# Altium schematic sheet Sheet1.SchDoc
size A2; SheetNumber: 1; SheetTotal: 1
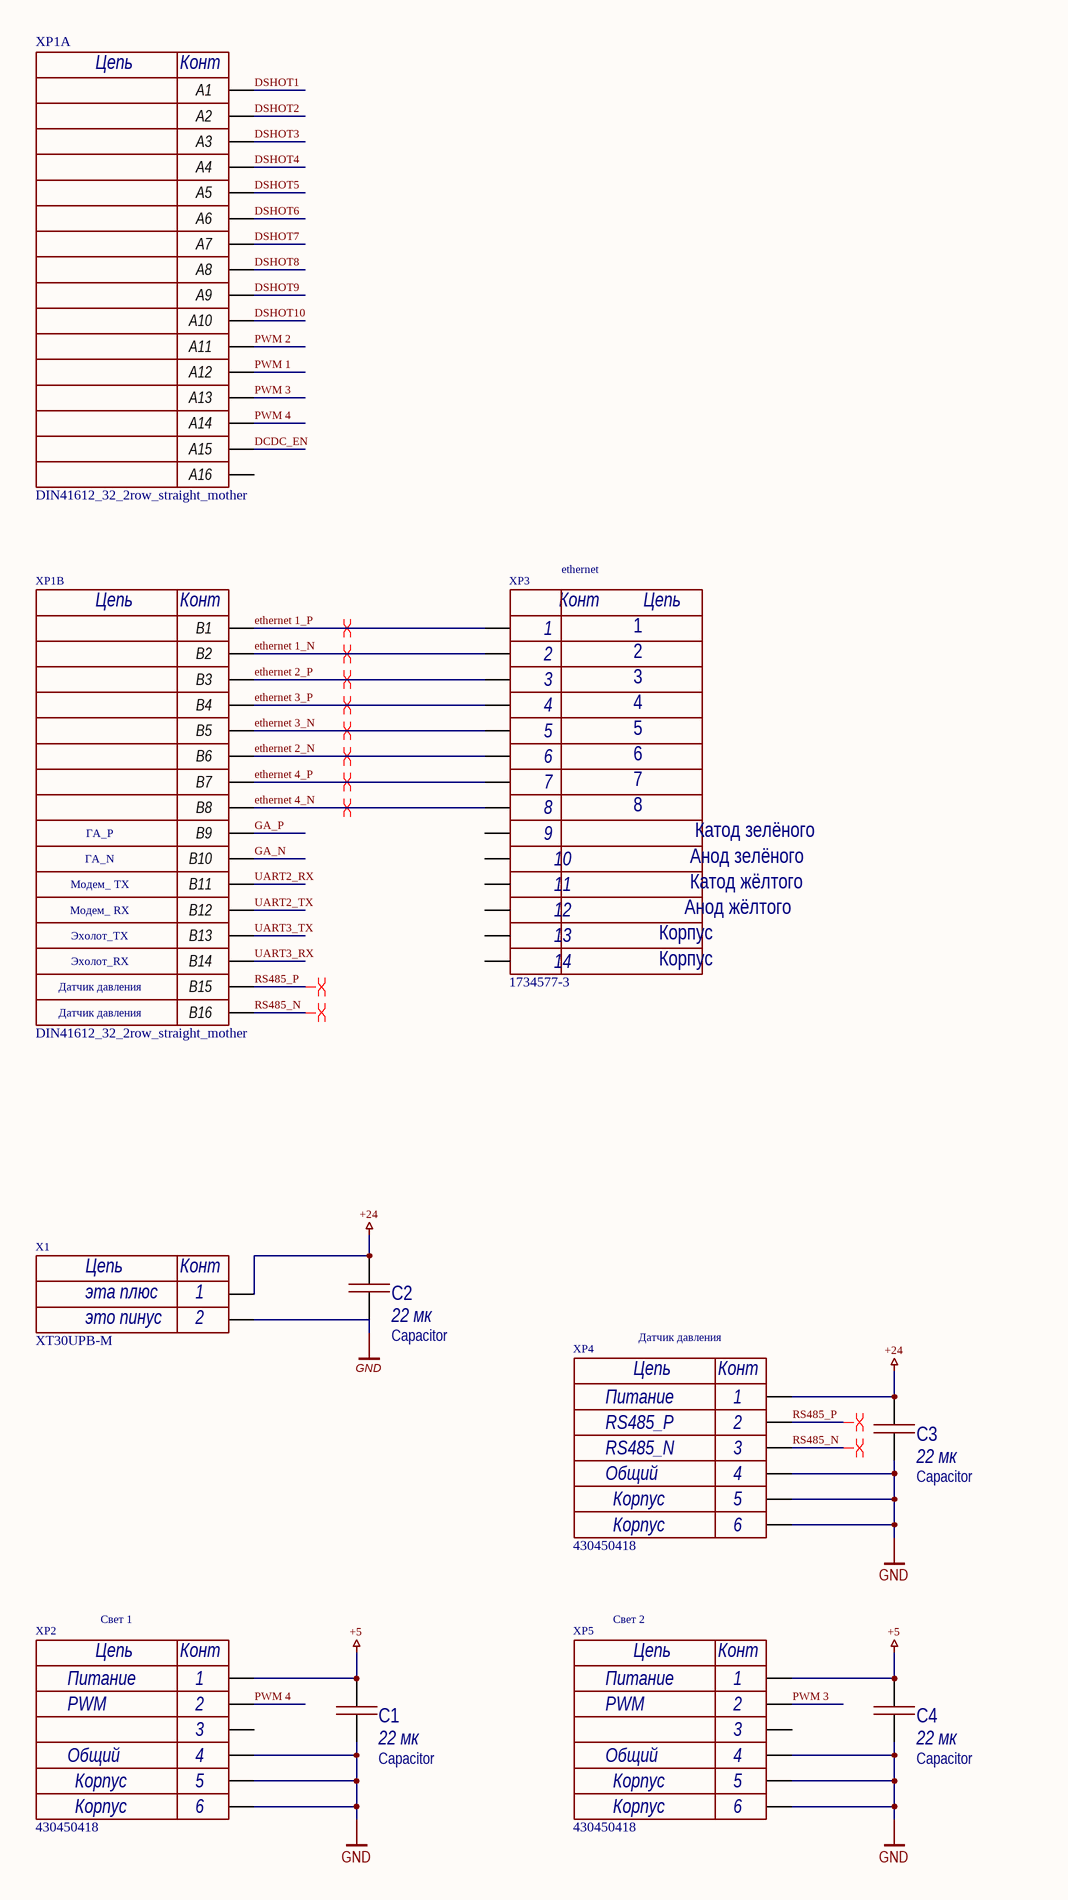
[diagram p0: Sheet1.SchDoc, left]
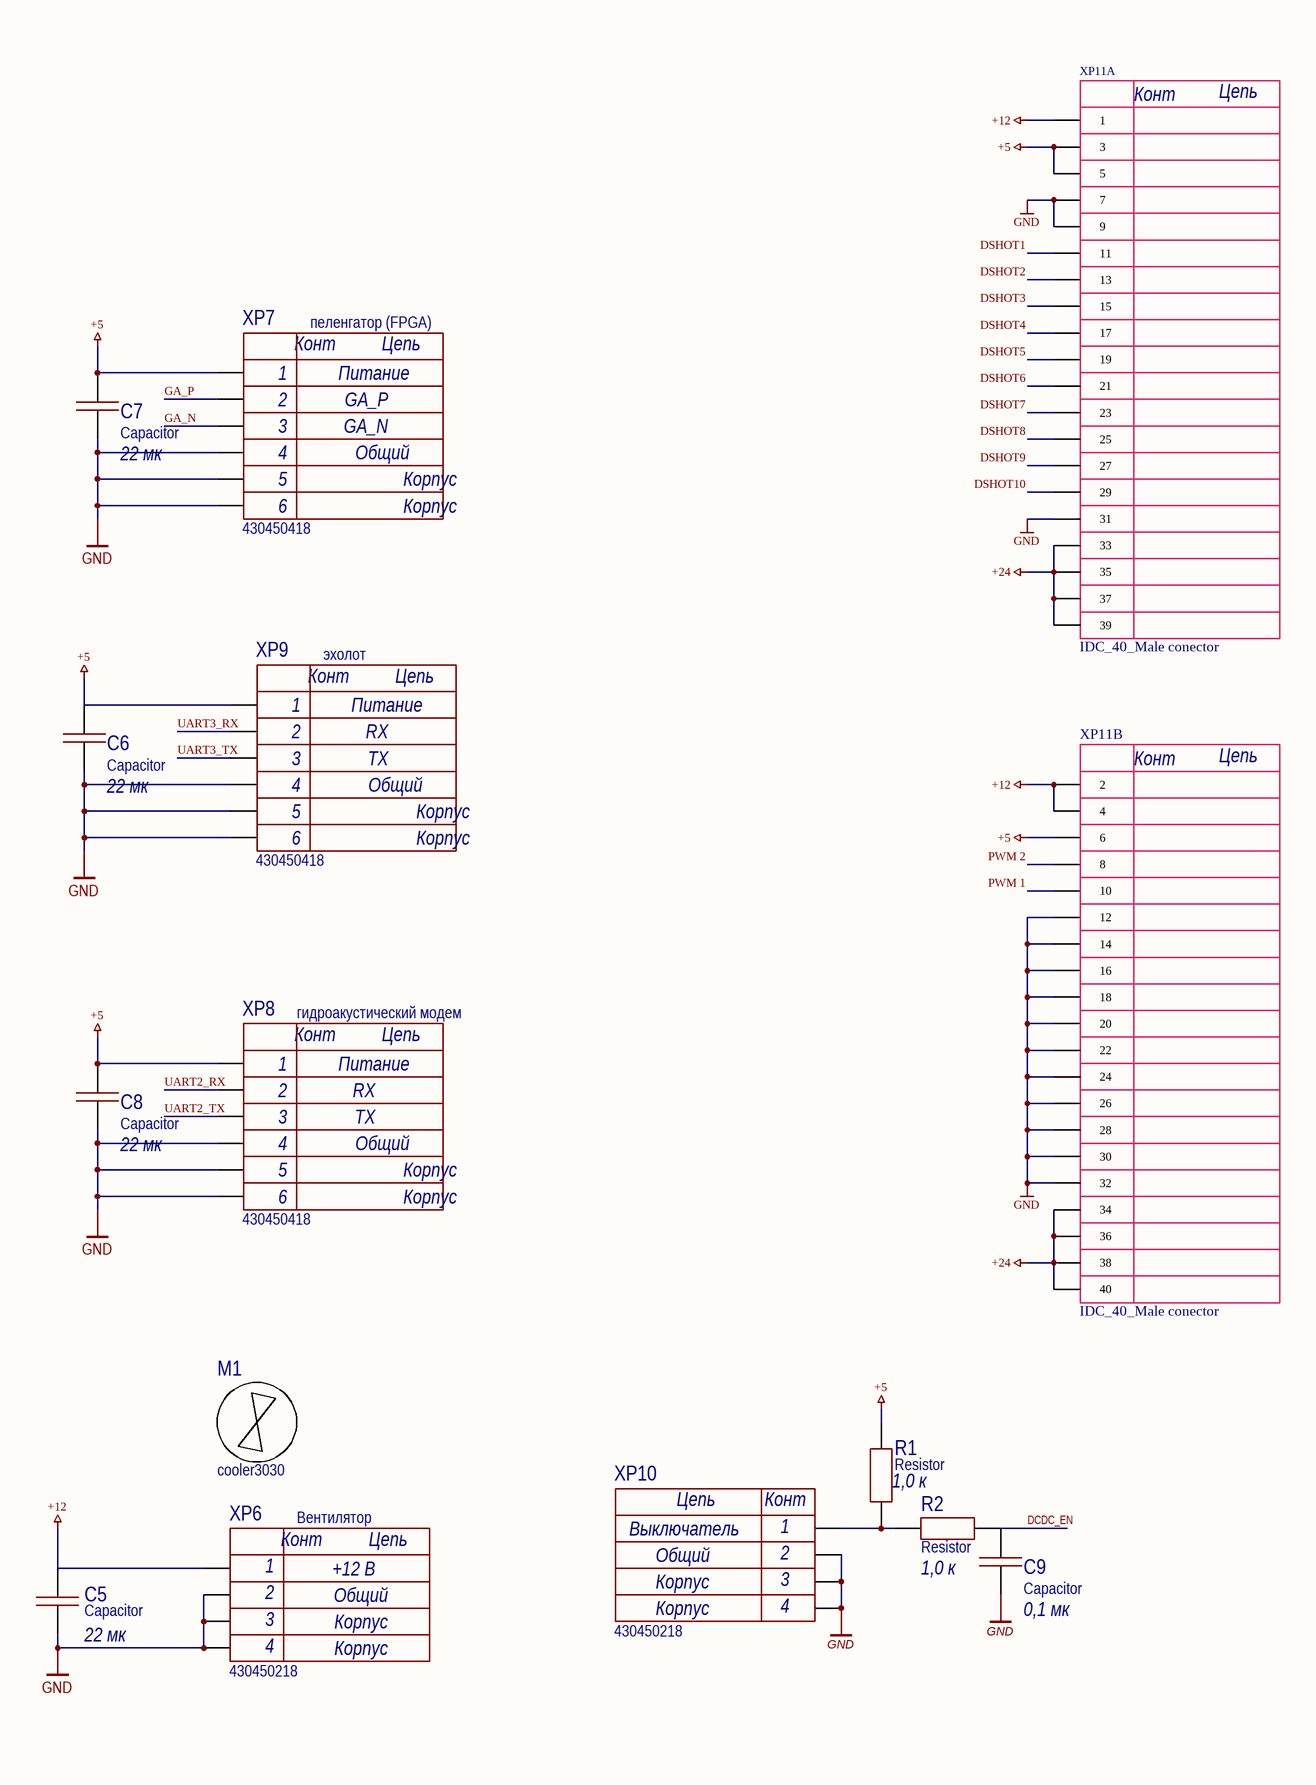
[diagram p1: Sheet1.SchDoc, right]

## Parts
C1  Capacitor  value 22 мк  [1210C]
C2  Capacitor  value 22 мк  [1210C]
C3  Capacitor  value 22 мк  [1210C]
C4  Capacitor  value 22 мк  [1210C]
C5  Capacitor  value 22 мк  [1210C]
C6  Capacitor  value 22 мк  [1210C]
C7  Capacitor  value 22 мк  [1210C]
C8  Capacitor  value 22 мк  [1210C]
C9  Capacitor  value 0,1 мк  [0603C]
M1  cooler3030  [cooler3030]
R1  Resistor  value 1,0 к  [0603R]
R2  Resistor  value 1,0 к  [0603R]
X1  XT30UPB-M  Value2: это пинус  Value1: эта плюс  [XT30UPB-M]
XP1  DIN41612_32_2row_straight_mother  [DIN41612_32_2row_straight_mother]  (parts A,B of 2)
XP2  430450418  Value1: Питание  Value2: PWM  Value4: Общий  [MOLEX_430450418]
XP3  1734577-3  [1-1734577-3-rj45-8p8c]
XP4  430450418  Value1: Питание  Value2: RS485_P  Value3: RS485_N  Value4: Общий  [MOLEX_430450418]
XP5  430450418  Value1: Питание  Value2: PWM  Value4: Общий  [MOLEX_430450418]
XP6  430450218  Value3: Корпус  Value2: Общий  Value1: +12 В  [Molex_430450218]
XP7  430450418  Value1: Питание  Value2: GA_P  Value3: GA_N  Value4: Общий  [MOLEX_430450418]
XP8  430450418  Value1: Питание  Value2: RX  Value3: TX  Value4: Общий  [MOLEX_430450418]
XP9  430450418  Value1: Питание  Value2: RX  Value3: TX  Value4: Общий  [MOLEX_430450418]
XP10  430450218  Value3: Корпус  Value2: Общий  Value1: Выключатель  [Molex_430450218]
XP11  IDC_40_Male conector  [IDC_40_Male conector]  (parts A,B of 2)

## Nets
+5: C1.2 C4.2 C6.2 C7.2 C8.2 R1.1 XP2.1 XP5.1 XP7.1 XP8.1 XP9.1 XP11.3 XP11.5 XP11.6
+12: C5.2 XP6.1 XP11.1 XP11.2 XP11.4
+24: C2.2 C3.2 X1.P XP4.1 XP11.33 XP11.34 XP11.35 XP11.36 XP11.37 XP11.38 XP11.39 XP11.40
GND: C1.1 C2.1 C3.1 C4.1 C5.1 C6.1 C7.1 C8.1 C9.1 X1.N XP2.0 XP2.4 XP4.0 XP4.4 XP5.0 XP5.4 XP6.0 XP6.2 XP7.0 XP7.4 XP8.0 XP8.4 XP9.0 XP9.4 XP10.0 XP10.2 XP11.7 XP11.9 XP11.12 XP11.14 XP11.16 XP11.18 XP11.20 XP11.22 XP11.24 XP11.26 XP11.28 XP11.30 XP11.31 XP11.32
DCDC_EN: C9.2 R2.2 XP1.A15
DSHOT1: XP1.A1 XP11.11
DSHOT2: XP1.A2 XP11.13
DSHOT3: XP1.A3 XP11.15
DSHOT4: XP1.A4 XP11.17
DSHOT5: XP1.A5 XP11.19
DSHOT6: XP1.A6 XP11.21
DSHOT7: XP1.A7 XP11.23
DSHOT8: XP1.A8 XP11.25
DSHOT9: XP1.A9 XP11.27
DSHOT10: XP1.A10 XP11.29
ethernet 1_N: XP1.B2 XP3.2
ethernet 1_P: XP1.B1 XP3.1
ethernet 2_N: XP1.B6 XP3.6
ethernet 2_P: XP1.B3 XP3.3
ethernet 3_N: XP1.B5 XP3.5
ethernet 3_P: XP1.B4 XP3.4
ethernet 4_N: XP1.B8 XP3.8
ethernet 4_P: XP1.B7 XP3.7
GA_N: XP1.B10 XP7.3
GA_P: XP1.B9 XP7.2
PWM 1: XP1.A12 XP11.10
PWM 2: XP1.A11 XP11.8
PWM 3: XP1.A13 XP5.2
PWM 4: XP1.A14 XP2.2
RS485_N: XP1.B16 XP4.3
RS485_P: XP1.B15 XP4.2
UART2_RX: XP1.B11 XP8.2
UART2_TX: XP1.B12 XP8.3
UART3_RX: XP1.B14 XP9.2
UART3_TX: XP1.B13 XP9.3
NetR1_2: R1.2 R2.1 XP10.1

Not connected (* = marked no-connect by the designer): XP1 A16; XP2 3; XP3 9 10 11 12 MH1 MH2; XP5 3

## Layout directives
differential pair: ethernet 1_N, ethernet 1_P, ethernet 2_N, ethernet 2_P, ethernet 3_N, ethernet 3_P, ethernet 4_N, ethernet 4_P, RS485_N, RS485_P

## Notes on the sheet
- пеленгатор (FPGA)
- ethernet
- эхолот
- ГА_P
- ГА_N
- Модем_ TX
- Модем_ RX
- Эхолот_TX
- Эхолот_RX
- Датчик давления
- гидроакустический модем
- Вентилятор
- Свет 1
- Свет 2
- (in symbol 1-1734577-3-rj45-8p8c) Конт; Цепь; Катод зелёного; Анод зелёного; Катод жёлтого; Анод жёлтого; 13; Корпус; 14
- (in symbol DIN41612_32_2row_straight_mother, part A) Цепь; Конт
- (in symbol DIN41612_32_2row_straight_mother, part B) Цепь; Конт
- (in symbol IDC_40_Male conector, part A) Цепь; Конт
- (in symbol IDC_40_Male conector, part B) Конт; Цепь
- (in symbol Molex_430450218) Конт; Цепь; 3; 4
- (in symbol Molex_430450418) Цепь; Конт; Корпус; 5; 6
- (in symbol XT30UPB-M) Цепь; Конт; 1; 2

## Library data of the parts
C1-C8 = Capacitor_22u_10_25V_X7R_1210C: Конденсатор; Tolerance: 0,1; Voltage (V): 25; Dielectric: X7R; Capacity (nF): 22000; Part Number: Capacitor_22u_10_25V_X7R_1210C
C9 = Capacitor_0,1u_10_50V_X7R_0603C: Конденсатор; Tolerance: 0,1; Voltage (V): 50; Dielectric: X7R; Capacity (nF): 100; Part Number: Capacitor_0,1u_10_50V_X7R_0603C
M1 = cooler3030: вентилятор 30*30 с дыркой на плате; Part Number: cooler3030
R1 R2 = Resistor_1.0k_1_0603: Резистор номиналом 1,0 кОм и точностью 1%; Power: *; Part Number: Resistor_1.0k_1_0603; Tolerance: 1%
X1 = XT30UPB-M: 2-пиновый разъем с ключом; System: Connector; Part Number: XT30UPB-M
XP1 = DIN41612_32_2row_straight_mother: DIN41612 (DS1118-32F0V23), Разъем (розетка) тип B 32pin (2х16), шаг 2.54мм двухрядный прямой (ряд АB); System: Connector; Part Number: DIN41612_32_2row_straight_mother
XP2 XP4 XP5 = Molex_430450418: Разъем типа провод-плата, 3 мм, 4 контакт(-ов), Штыревой Разъем, для поверностного монтажа; System: Connector; Part Number: Molex_430450418
XP3 = 1-1734577-3-rj45-8p8c: Модульный разъем, Cat3, RJ45, Гнездо, 8 контакт(-ов), 8 вывод(-ов), 1 порт(-ов); System: Connector; Part Number: 1-1734577-3-rj45-8p8c
XP6 XP10 = Molex_430450218: Разъем типа провод-плата, 3 мм, 2 контакт(-ов), Штыревой Разъем, Серия Micro-Fit для поверхностного монтажа; Value4: Корпус; Part Number: Molex_430450218
XP7-XP9 = Molex_430450418: Разъем типа провод-плата, 3 мм, 4 контакт(-ов), Штыревой Разъем, для поверностного монтажа; Part Number: Molex_430450418
XP11 = IDC_40_Male conector: IDC 40-пиновый разъём прямая вилка; System: Connector; Part Number: IDC_40_Male conector